# EAGLE schematic input (EAGLE 9.6.2)
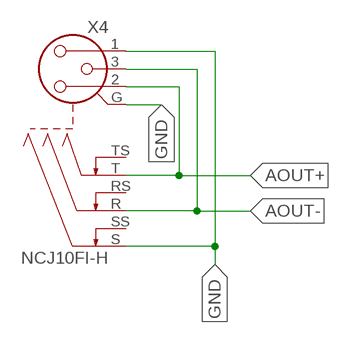
[diagram p0: schematic, sheet 1]

## Parts
X4  NCJ10FI-H  [NCJ10FI-H]

## Nets
AOUT+: X4.2 X4.T
AOUT-: X4.3 X4.R
GND: X4.1 X4.G X4.S
Unconnected: X4.RS X4.SS X4.TS

## Library data of the parts
X4 = con-neutrik_ag:NCJ10FI-: Neutrik Audio Connector XLR SERIES Stereo 1/4" jack with switch Source: www.neutrik.com/; OC_FARNELL: unknown; OC_NEWARK: unknown